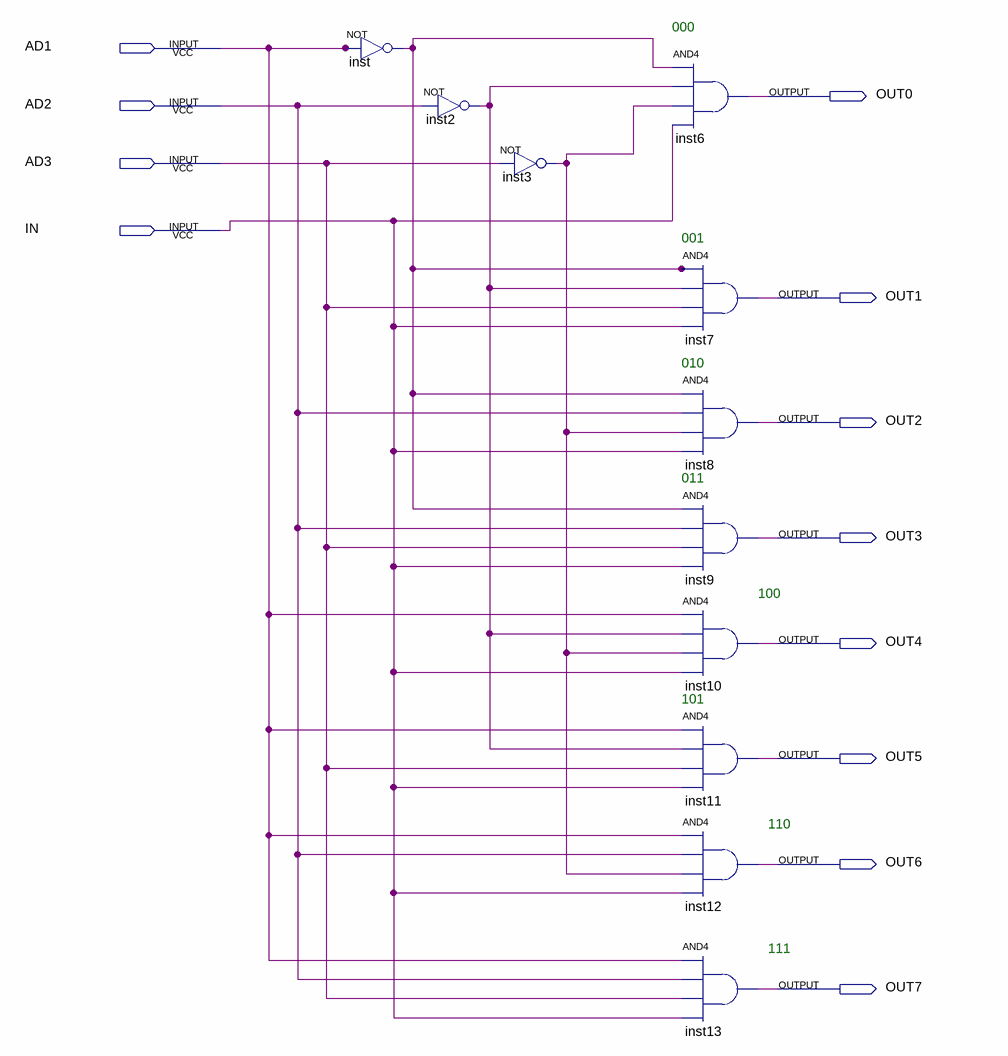
[diagram p0: schematic sheet]
// Quartus schematic lab21.bdf as structural Verilog: 11 symbols, 12 pins
module lab21 (
  input  AD1,
  input  AD2,
  input  AD3,
  input  IN,
  output OUT0,
  output OUT1,
  output OUT2,
  output OUT3,
  output OUT4,
  output OUT5,
  output OUT6,
  output OUT7
);

  wire inst2_out, inst3_out, inst_out;

  not inst (inst_out, AD1);
  not inst2 (inst2_out, AD2);
  not inst3 (inst3_out, AD3);
  and inst6 (OUT0, inst_out, inst2_out, inst3_out, IN);
  and inst7 (OUT1, inst_out, inst2_out, AD3, IN);
  and inst8 (OUT2, inst_out, AD2, inst3_out, IN);
  and inst9 (OUT3, inst_out, AD2, AD3, IN);
  and inst10 (OUT4, AD1, inst2_out, inst3_out, IN);
  and inst11 (OUT5, AD1, inst2_out, AD3, IN);
  and inst12 (OUT6, AD1, AD2, inst3_out, IN);
  and inst13 (OUT7, AD1, AD2, AD3, IN);

  // Notes on the sheet:
  //   000
  //   001
  //   010
  //   011
  //   100
  //   101
  //   110
  //   111
endmodule
